# Altium schematic sheet Un_interruptable_power_supply_180534N_Schematic.SchDoc
size A; Author: 180534N; DrawnBy: Achintha Rathnayake
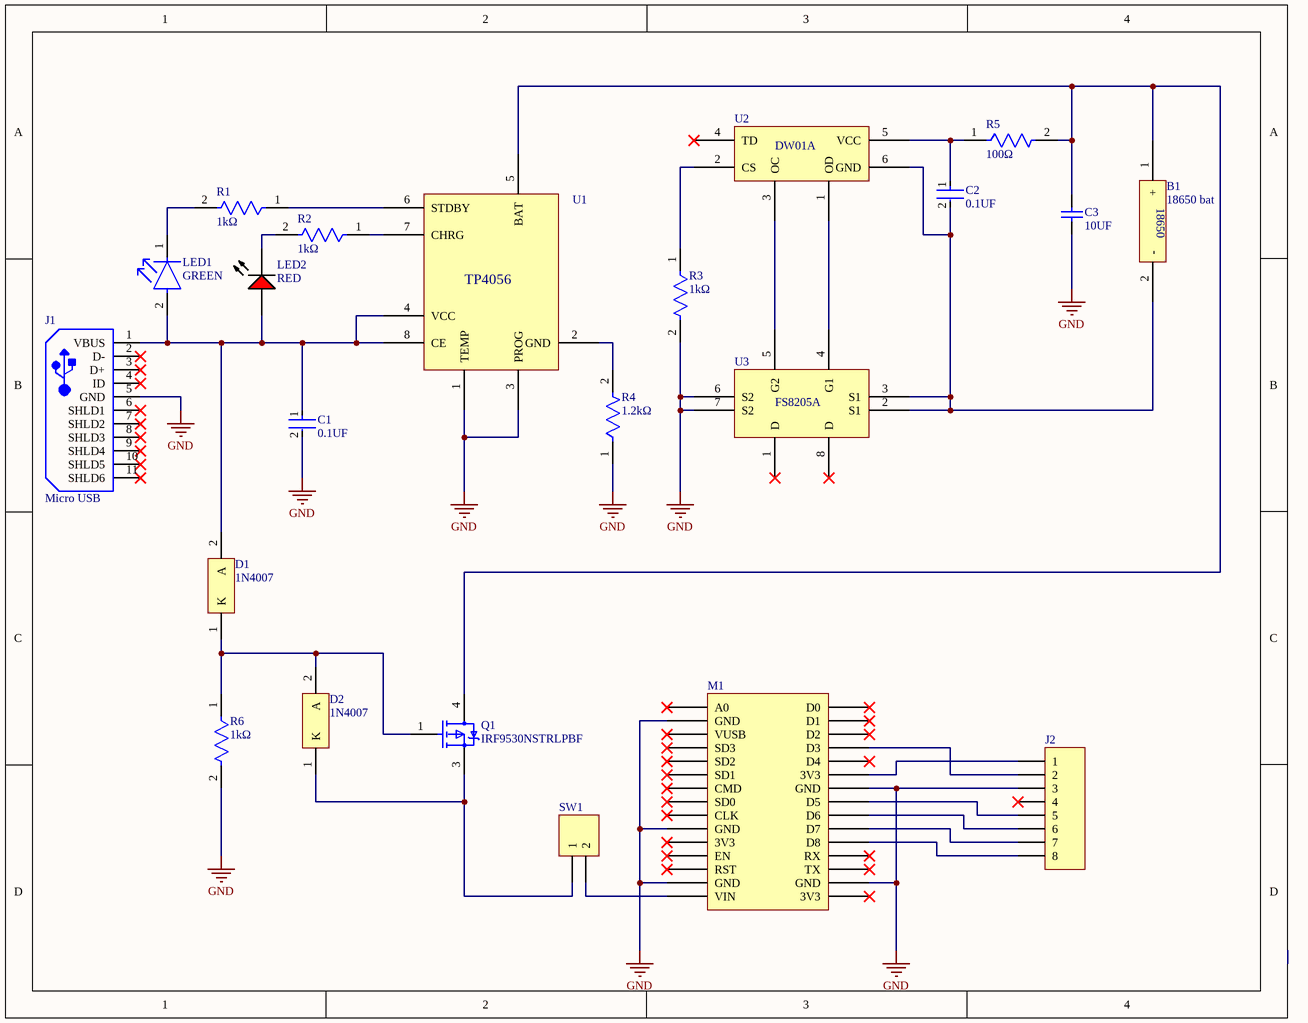
[diagram p0: Un_interruptable_power_supply_180534N_Schematic.SchDoc]

## Parts
B1  18650 bat  [18650 Battery connect]
C1  0.1UF  [FP-C0603C-CF-MFG]
C2  0.1UF  [FP-C0603C-CF-MFG]
C3  10UF  [MURA-0805_H_1.35_M]
D1  1N4007  [ONSC-AXIAL_LEAD-2-59-10_P]
D2  1N4007  [ONSC-AXIAL_LEAD-2-59-10_P]
J1  Micro USB  [USB-MICRO-B_V]
J2  Header 8  [HDR1X8]  (value not drawn)
LED1  GREEN  [FP-LTST-C190GKT-MFG]
LED2  RED  [AVAG-HSMX-C190_V]
M1  NodeMCU V1.0 ESP-12E_1  [LoLin NodeMcu V3]  (value not drawn)
Q1  IRF9530NSTRLPBF  [FP-PG-TO263-3-MFG]
R1  1kΩ  [FP-CRCW0603-e3-MFG]
R2  1kΩ  [FP-CRCW0603-e3-MFG]
R3  1kΩ  [FP-CRCW0603-e3-MFG]
R4  1.2kΩ  [FP-CRCW0603-e3-MFG]
R5  100Ω  [FP-CRCW0402-e3-IPC_C]
R6  1kΩ  [FP-CRCW0603-e3-MFG]
SW1  Header 2  [HDR1X2]  (value not drawn)
U1  TP4056  [TP4056 IC - SOIC_8 Package]  (value not drawn)
U2  DW01A  [DW01A - SOT 23-6 PACKAGE]  (value not drawn)
U3  FS8205A  [FS8205A - TSSOP-8 PACKAGE]  (value not drawn)

## Nets
GND: C1.2 C3.1 J1.5(GND) J2.3 M1.GND R3.2 R4.1 R6.2 U1.1(TEMP) U1.3(PROG) U3.6(S2) U3.7(S2)
NetB1_1: B1.1(+) C3.2 Q1.4(D) R5.2 U1.5(BAT)
NetB1_2: B1.2(-) C2.2 U2.6(GND) U3.2(S1) U3.3(S1)
NetC1_1: C1.1 D1.2(A) J1.1(VBUS) LED1.2(A) LED2.1(A) U1.4(VCC) U1.8(CE)
NetC2_1: C2.1 R5.1 U2.5(VCC)
NetD1_1: D1.1(K) D2.2(A) Q1.1(G) R6.1
NetD2_1: D2.1(K) Q1.3(S) SW1.1
NetJ2_1: J2.1 M1.3V3
NetJ2_2: J2.2 M1.D3
NetJ2_5: J2.5 M1.D5
NetJ2_6: J2.6 M1.D6
NetJ2_7: J2.7 M1.D7
NetJ2_8: J2.8 M1.D8
NetLED1_1: LED1.1(C) R1.2
NetLED2_2: LED2.2(K) R2.2
NetM1_VIN: M1.VIN SW1.2
NetR1_1: R1.1 U1.6(STDBY)
NetR2_1: R2.1 U1.7(CHRG)
NetR3_1: R3.1 U2.2(CS)
NetR4_2: R4.2 U1.2(GND)
NetU2_1: U2.1(OD) U3.4(G1)
NetU2_3: U2.3(OC) U3.5(G2)

Not connected (* = marked no-connect by the designer): J1 2(D-)* 3(D+)* 4(ID)* 6(SHLD1)* 7(SHLD2)* 8(SHLD3)* 9(SHLD4)* 10(SHLD5)* 11(SHLD6)*; J2 4*; M1 A0* CLK* CMD* D0* D1* D2* D4* EN* RST* RX* SD0* SD1* SD2* SD3* TX* VUSB*; U2 4(TD)*; U3 1(D)* 8(D)*

## Notes on the sheet
- (in symbol 18650 battery) 18650

## Library data of the parts
B1 = 18650 battery
C1 C2 = CMP-2006-03061-2: CAP CER 0.1UF 50V X7R 0603; Manufacturer: KEMET; Manufacturer Part Number: C0603C104K5RACTU; Tolerance: 0.1; Temperature Coefficient: 30ppm/°C; Material: Ceramic; Automotive Grade: Grade 1; Value: 0.10 μF; Temperature: -55°C to +125°C; RoHS: TRUE; Temperature Range High: +125°C; Lead Free: Yes; Octopart: https://octopart.com/c0603c104k5ractu-kemet-139244; Digikey Description: CAP CER 0.1UF 50V X7R 0603; Category: Cap; Package: C0603C-CF; ComponentLink2Description: Datasheet; Temperature Range Low: -55°C; Device Class L1: Passive Components; Voltage Rating: 50 V; Automotive: Yes; Device Class L3: Ceramic Capacitors; ComponentLink2URL: https://api.kemet.com/component-edge/download/datasheet/C0603C100J5GACAUTO.pdf; Capacitance: 0.10 μF; Device Class L2: Capacitors; Temperature Characteristic: X7R; Height: 0.87mm
C3 = CMP-2000-05254-1: CAP, Ceramic, 10 uF, 10%, 10 V, 0805, RoHS, Tape and Reel; Manufacturer: Murata; Voltage - Rated: 10V; Product Training Modules: High-CapMultilayerCeramicCapacitors; Catalog Drawings: GRMSeries_0805_1.25; Temperature Coefficient: X5R; Online Catalog: GRMSeries; Featured Product: GA3SafetyRecognizedCapsandHi-CapMLCC; Capacitance: 10µF; Other Names: 490-1709-6; Applications: GeneralPurpose; Category: Capacitors; Datasheet Version: Aug-14; Datasheet URL: https://datasheet.ciiva.com/3777/210grm21br61a106ke1923-3777175.pdf; Ratings: -; Height - Seated (Max): -; Lead Spacing: -; Operating Temperature: -55degC~85degC; Features: -; Package Description: 2-Pin Surface Mount Device (0805), Body 2.1 x 1.35 mm; Standard Package: 1; Mounting Type: SurfaceMount,MLCC; Package Reference: 805; Tolerance: ±10%; Manufacturer URL: http://www.murata.com/; Size / Dimension: 0.079"Lx0.049"W(2.00mmx1.25mm); Packaging: Digi-Reel; Thickness (Max): 0.053"(1.35mm); Package / Case: 0805(2012Metric); Family: CeramicCapacitors; Series: GRM; Lead Style: -
D1 D2 = CMP-0902-00142-1: Standard Recovery Rectifier, 2-Pin Axial_Lead, Pb-Free, Bulk Bag; Manufacturer: On Semiconductor; IO(rec) Max (A): 1; IFSM Max (A): 30; VRRM Max (V): 1000; ComponentLink3URL: http://www.onsemi.cn/pub_link/Collateral/59-10.PDF; PackageVersion: Rev. U, 02/2005; PackageDescription: 2-Pin, Axial Lead, Diameter 2.35 mm; PackageReference: AXIAL_LEAD-2-59-10; RoHS: TRUE; PartNumber: 1N4007; Packing: Bulk Bag; DatasheetVersion: Rev. 13; ComponentLink3Description: Package Specification; ComponentLink1Description: Manufacturer URL; ComponentLink2URL: http://www.onsemi.com/pub_link/Collateral/1N4001-D.PDF; ComponentLink1URL: http://www.onsemi.com/; Type: Standard Recovery; ComponentLink2Description: Datasheet; Mounting Technology: Through Hole
J1 = CMP-2000-05827-1: Micro-USB B Receptacle, Right Angle, Bottom Mount, Surface Mount, with Solder Tabs, -30 to 85 degC, 5-Pin USB, RoHS, Tape and Reel; Manufacturer: Molex; Featured Product: Micro-USBConnectorsUSBConnectors; Other Names: WM1399DKR; Package Version: Rev. F, 12/2012; Number of Contacts: 5; Connector Type: USB-microB; Catalog Drawings: 1050170001; 3D Model: 105017-0001.stp; Mating Products: WM17145-ND-CABLEMICROUSBBTOSTDA1.0MWM17147-ND-CABLEMICROUSBBTOSTDA2.0MWM17146-ND-CABLEMICROUSBBTOSTDA1.5M; PCN Assembly/Origin: ResinSupplier21/Oct/2015; Voltage - Max: 30V; Online Catalog: Molex-MicroUSB; Manufacturer URL: http://www.molex.com/; Package Description: 5-Leads USB, Micro B, Body 7.5 x 5 mm, Pitch 0.65 mm; Datasheet URL: http://www.molex.com/elqNow/elqRedir.htm?ref=http://www.molex.com/webdocs/datasheets/pdf/en-us/1050170001_IO_CONNECTORS.pdf; Ingress Protection: -; Datasheet Version: 03/2016; Mounting Type: BoardCutout,SurfaceMount,RightAngle; Circuits: 5; Standard Package: 1; Package Reference: MICRO-B; Package URL: http://www.molex.com/pdm_docs/sd/1050170001_sd.pdf; Category: Connectors,Interconnects; Series: -; RoHS Information: 1050170001CertofCompliance; Features: Shielded,SolderRetention; Family: USB,DVI,HDMIConnectors; Specifications: -; Gender: Receptacle; Packaging: Digi-Reel®; Mounting Technology: SurfaceMount
J2 = Header 8: Header, 8-Pin; LatestRevisionDate: 17-Jul-2002; LatestRevisionNote: Re-released for DXP Platform.; Publisher: Altium Limited
LED1 = CMP-22017-000005-2: LED GREEN CLEAR CHIP SMD; Dominant Wavelength: 569nm; Reverse Voltage: 5V; Lens Color: Colorless; Viewing Angle: 130°; Voltage: 2V; Forward Current: 30mA; Power Dissipation: 100mW; Luminous Intensity: 6mcd; Number of LEDs: 1; Forward Voltage: 2.1V; Wavelength: 565nm; Test Current: 10mA; Min Operating Temperature: -55°C; Lens Style: Clear; Mount: Surface Mount; Width: 0.8mm; Packaging: Tape and Reel; Lens Transparency: Clear; Case Code (Metric): 1608; Depth: 0.8mm; Case Code (Imperial): 0603; Case/Package: 0603; Number of Pins: 2; Max Operating Temperature: 85°C; Lead Free: Lead Free; Number of Elements: 1; Length: 1.6mm; Height: 0.8mm; Package Quantity: 1; Power Rating: 100mW; Radiation Hardening: No; Illumination Color: Green; Color: Green
LED2 = CMP-1744-00004-1: LED Uni-Color Red, 65 mW, 20 mA, -40 to 85 degC, 2-Pin SMD, RoHS, Tape and Reel; Connector Type: USB; Gender: Male; Current Rating: 1 A; Length: 7.5 mm; Lead Pitch: 0.65 mm; PackageReference: HSMX-C190; Package Quantity: 2000; Max Operating Temperature: 85 degC; PackageDescription: 2-Pin Surface Mount Device, Body 1.6 x 0.8 mm, Height 0.9 mm; ComponentLink3Description: Package Specification; Mount: Surface Mount; Min Operating Temperature: -30 degC; ComponentLink3URL: http://www.fairchildsemi.com/dwg/MA/MA03D.pdf; ComponentLink1Description: Manufacturer URL; Contact Material: Copper; Pins: 5; Width: 5.6 mm; ComponentLink2Description: Datasheet; RoHSCompliant: true; DatasheetVersion: Mar-12; Height: 2.8 mm; Packaging: Tape and Reel; Contact Plating: Gold; ComponentLink1URL: http://www.avagotech.com/; REACH SVHC: No SVHC; ComponentLink2URL: http://docs.avagotech.com/docs/AV02-0551EN
M1 = NodeMCU V1.0 ESP-12E_1: LoLin NodeMCU V3
Q1 = CMP-32901-000018-2: MOSFET P-CH 100V 14A D2PAK; Drain to Source Voltage (Vdss): -100V; Power Dissipation: 79W; Gate to Source Voltage (Vgs): 20V; Input Capacitance: 760pF; Drain to Source Resistance: 200mR; Turn-On Delay Time: 15ns; Turn-Off Delay Time: 45ns; Rise Time: 58ns; Max Power Dissipation: 3.8W; Halogen Free: Not Halogen Free; Number of Pins: 3; RoHS Compliant: Yes; Width: 0.38inch; Continuous Drain Current (ID): 14A; Length: 0.42inch; Max Operating Temperature: 175°C; Packaging: Tape and Reel; Contact Plating: Tin; Min Operating Temperature: -55°C; Lead Free: Contains Lead; Max Dual Supply Voltage: -100V; Case/Package: D2PAK; Rds On Max: 200mR; Height: 0.19inch; Mount: Surface Mount; Drain to Source Breakdown Voltage: -100V
R1-R3 R6 = CMP-1666-00003-5: RES Thick Film, 1kΩ, 1%, 0.1W, 100ppm/°C, 0603; Max Power Dissipation: 100mW; Voltage Rating: 75V; Resistance: 1kR; Max Operating Temperature: 155°C; Number of Pins: 2; Case Code (Imperial): 0603; Width: 0.033inch; Power Rating: 100mW; Number of Terminations: 2; Package Quantity: 10; Weight: 7.1E-05oz; Tolerance: 1%; Temperature Coefficient: 100ppm/°C; Military Standard: Not; Mount: Surface Mount; Voltage Rating (DC): 75V; Depth: 0.85mm; Composition: Thick Film; Radiation Hardening: No; Termination: SMD/SMT; Length: 1.55mm; Case Code (Metric): 1608; Contact Plating: Tin; Min Operating Temperature: -55°C; Packaging: Tape and Reel; Height: 0.45mm; Lead Free: Lead Free; Case/Package: 0603; Features: Automotive AEC-Q200
R4 = CMP-2000-02982-2: RES Thick Film, 1.2kΩ, 1%, 0.1W, 100ppm/°C, 0603; Max Power Dissipation: 100mW; Resistance: 1.2kR; Voltage Rating: 75V; Package Quantity: 10; Weight: 7.1E-05oz; Packaging: Tape and Reel; Max Operating Temperature: 155°C; Case/Package: 0603; Case Code (Imperial): 0603; Length: 1.55mm; Width: 0.033inch; Radiation Hardening: No; Power Rating: 100mW; Depth: 0.85mm; Military Standard: Not; Case Code (Metric): 1608; Tolerance: 1%; Termination: SMD/SMT; Temperature Coefficient: 100ppm/°C; Mount: Surface Mount; Min Operating Temperature: -55°C; Lead Free: Lead Free; Contact Plating: Tin; Composition: Thick Film; Voltage Rating (DC): 75V; Features: Automotive AEC-Q200; Height: 0.45mm; Number of Terminations: 2
R5 = CMP-1011-00397-3: RES Thick Film, 100Ω, 1%, 0.063W, 100ppm/°C, 0402; Max Power Dissipation: 63mW; Voltage Rating: 50V; Resistance: 100R; Package Quantity: 10; Lead Free: Lead Free; Termination: SMD/SMT; Case Code (Metric): 1005; Number of Terminations: 2; Composition: Thick Film; Voltage Rating (DC): 50V; Min Operating Temperature: -55°C; Case/Package: 0402; Radiation Hardening: No; Max Operating Temperature: 155°C; Temperature Coefficient: 100ppm/°C; Military Standard: Not; Length: 1mm; Mount: Surface Mount; Power Rating: 63mW; Weight: 2.3E-05oz; Working Voltage: 50V; Features: Automotive AEC-Q200; Depth: 0.5mm; Packaging: Tape and Reel; Tolerance: 1%; Height: 0.35mm; Case Code (Imperial): 0402; Width: 0.02inch; Contact Plating: Tin
SW1 = Header 2: Header, 2-Pin; LatestRevisionDate: 17-Jul-2002; LatestRevisionNote: Re-released for DXP Platform.; Publisher: Altium Limited
U1 = TP4056: 18650 single cell charge controller/ Constant current, Constant Voltage available/ Max input 4.5V~6V/ Max current 1A/ Float voltage 4.2V
U2 = DW01A: 18650 Battery Protection IC/ Provide over current, over charge and over discharge protection
U3 = FS8205A: Dual N channel MOSFET